# Altium schematic sheet PX4FMUv2.4.6_08.SchDoc: PX4FMUv2.4.6.sch
size 282 x 200 mm; Date: 2015/3/26 21:06:21; SheetNumber: Sheet:
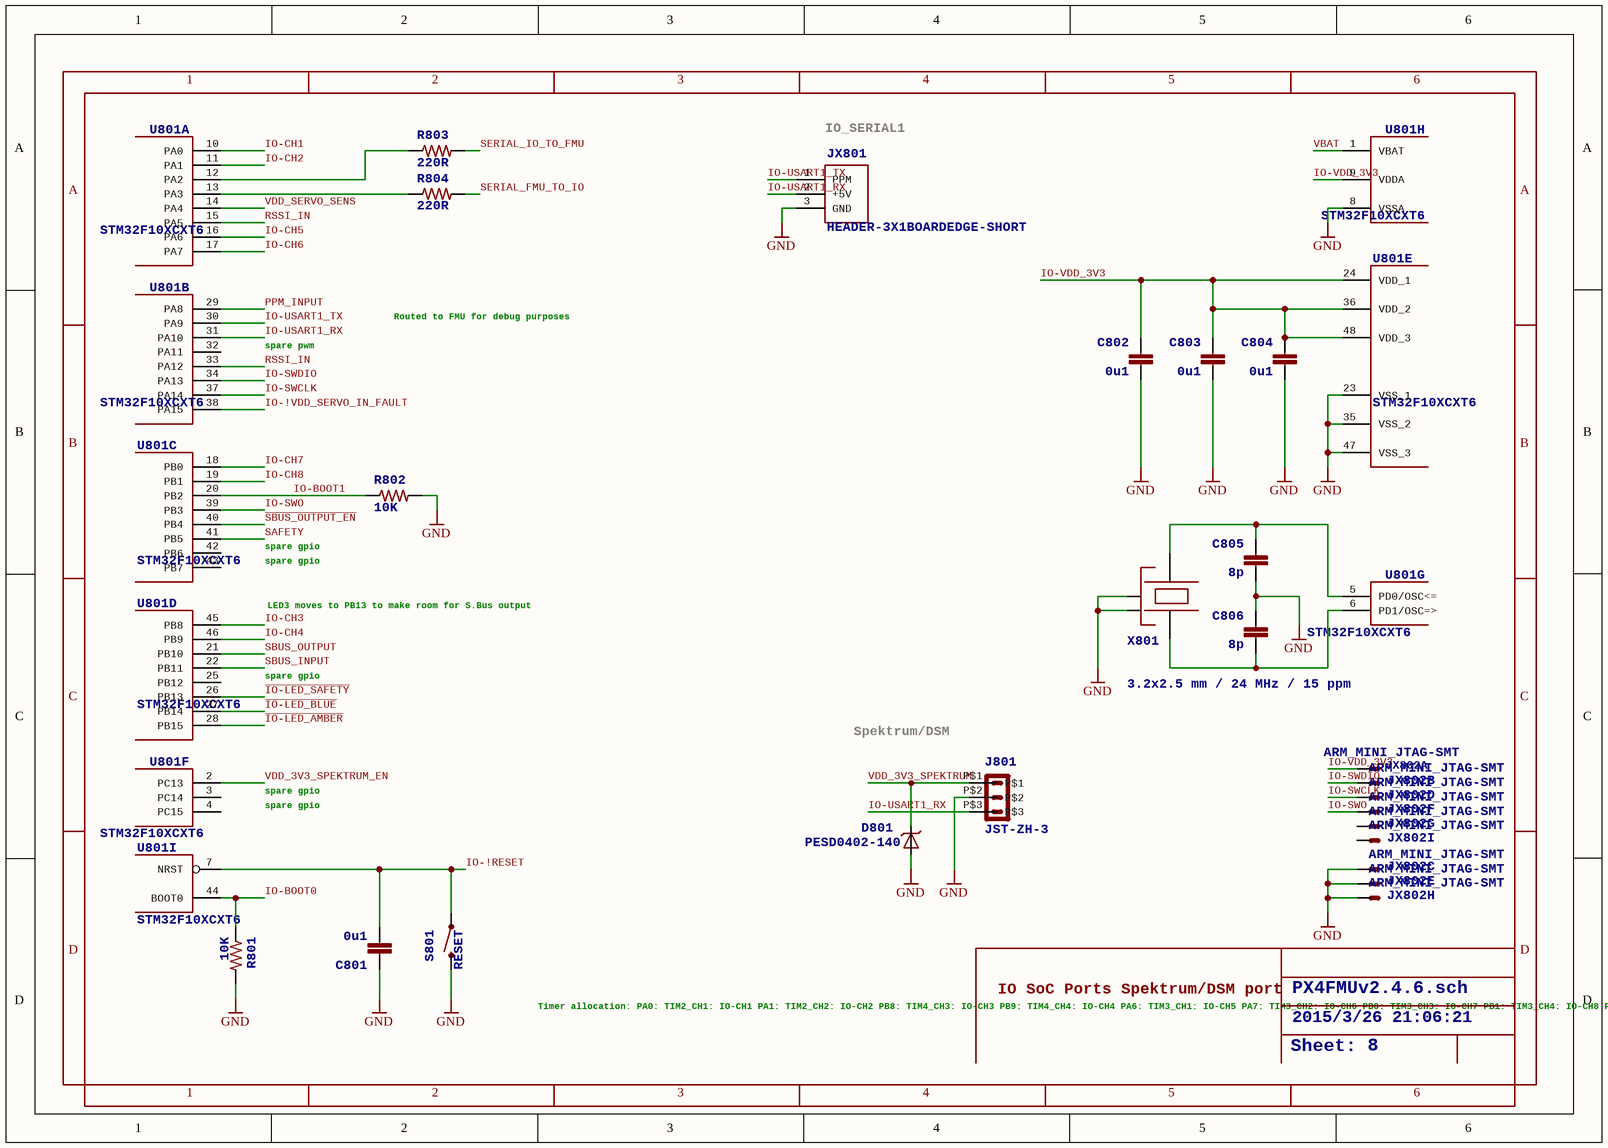
[diagram p0: PX4FMUv2.4.6_08.SchDoc]

## Parts
C801  0u1  [0402-CAP]
C802  0u1  [0402-CAP]
C803  0u1  [0402-CAP]
C804  0u1  [0402-CAP]
C805  8p  [0402-CAP]
C806  8p  [0402-CAP]
D801  PESD0402-140  [0402-TVS]
J801  JST-ZH-3  [JST-ZH-SMT-VERTICAL]
JX801  HEADER-3X1BOARDEDGE-SHORT  [HEADER_3X01_SMD_H_BOARD_EDGE_SHORT]
JX802  ARM_MINI_JTAG-SMT  [FTSH-105-01-XXX-DV-K]  (parts A,B,C,D,E,F,G,H,I of 9)
R801  10K  [0402-RES]
R802  10K  [0402-RES]
R803  220R  [0402-RES]
R804  220R  [0402-RES]
S801  RESET  [EVQP7J01K]
U801  STM32F10XCXT6  [TQFP48]  (parts A,B,C,D,E,F,G,H,I of 9)
X801  3.2x2.5 mm / 24 MHz / 15 ppm  [OSCILLATOR-3.2X2.5]

## Nets
GND: C801.P$1 C802.P$2 C803.P$2 C804.P$2 C805.P$2 C806.P$1 D801.A J801.P$2 JX801.3(GND) JX802.3(S) JX802.5(S) JX802.9(S) R801.P$2 R802.P$2 S801.B3 U801.8(VSSA) U801.23(VSS_1) U801.35(VSS_2) U801.47(VSS_3) X801.2(NC_2) X801.4(NC_4)
~{IO-LED_AMBER}: U801.28(PB15)
~{IO-LED_BLUE}: U801.27(PB14)
~{IO-LED_SAFETY}: U801.26(PB13)
IO-!RESET: C801.P$2 S801.A1 U801.7(NRST)
IO-!VDD_SERVO_IN_FAULT: U801.38(PA15)
IO-BOOT0: R801.P$1 U801.44(BOOT0)
IO-BOOT1: R802.P$1 U801.20(PB2)
IO-CH1: U801.10(PA0)
IO-CH2: U801.11(PA1)
IO-CH3: U801.45(PB8)
IO-CH4: U801.46(PB9)
IO-CH5: U801.16(PA6)
IO-CH6: U801.17(PA7)
IO-CH7: U801.18(PB0)
IO-CH8: U801.19(PB1)
IO-SWCLK: JX802.4(S) U801.37(PA14)
IO-SWDIO: JX802.2(S) U801.34(PA13)
IO-SWO: JX802.6(S) U801.39(PB3)
IO-USART1_RX: J801.P$3 JX801.2(+5V) U801.31(PA10)
IO-USART1_TX: JX801.1(PPM) U801.30(PA9)
IO-VDD_3V3: C802.P$1 C803.P$1 C804.P$1 JX802.1(S) U801.9(VDDA) U801.24(VDD_1) U801.36(VDD_2) U801.48(VDD_3)
PPM_INPUT: U801.29(PA8)
RSSI_IN: U801.15(PA5) U801.33(PA12)
~{SBUS_OUTPUT_EN}: U801.40(PB4)
SAFETY: U801.41(PB5)
SBUS_INPUT: U801.22(PB11)
SBUS_OUTPUT: U801.21(PB10)
SERIAL_FMU_TO_IO: R804.P$2
SERIAL_IO_TO_FMU: R803.P$2
VBAT: U801.1(VBAT)
VDD_3V3_SPEKTRUM: D801.C J801.P$1
VDD_3V3_SPEKTRUM_EN: U801.2(PC13)
VDD_SERVO_SENS: U801.14(PA4)
NetC805_P$1: C805.P$1 U801.5(PD0/OSC<=) X801.3
NetC806_P$2: C806.P$2 U801.6(PD1/OSC=>) X801.1
NetR803_P$1: R803.P$1 U801.12(PA2)
NetR804_P$1: R804.P$1 U801.13(PA3)

Not connected (* = marked no-connect by the designer): JX802 8(S) 10(S); U801 3(PC14) 4(PC15) 25(PB12) 32(PA11) 42(PB6) 43(PB7)

## Notes on the sheet
- (near JX801) IO_SERIAL1
- spare pwm
- Routed to FMU for debug purposes
- spare gpio
- LED3 moves to PB13 to make room for S.Bus output
- Spektrum/DSM
- Timer allocation:
  PA0: TIM2_CH1: IO-CH1
  PA1: TIM2_CH2: IO-CH2
  PB8: TIM4_CH3: IO-CH3
  PB9: TIM4_CH4: IO-CH4
  PA6: TIM3_CH1: IO-CH5
  PA7: TIM3_CH2: IO-CH6
  PB0: TIM3_CH3: IO-CH7
  PB1: TIM3_CH4: IO-CH8
  PA8: TIM1_CH1: PPM_IN
  PA11: TIM1_CH4: RSSI_IN
- IO SoC Ports
  Spektrum/DSM port
- 1
- 2
- 3
- 4
- 5
- 6
- A
- B
- C
- D

## Library data of the parts
C801-C804 = CAP0402: <b>Capacitor</b> / Standard 0603 ceramic capacitor, and 0.1" leaded capacitor.; PARTNO: CC0402ZRY5V7BB104
C805 C806 = CAP0402: <b>Capacitor</b> / Standard 0603 ceramic capacitor, and 0.1" leaded capacitor.; PARTNO: C1005C0G1H080C
D801 = DIODE-TVS
J801 = JST-ZH-3: PARTNO: B3B-ZR-SM4-TF (LF)(SN)(P)
JX801 = HEADER-3X1BOARDEDGE-SHORT: <h3>Single row 0.1" servo header</h3>; BOM: EXCLUDE
JX802 = ARM_MINI_JTAG-SMT: <b>CONNECTOR</b><p> / wire to board 1.25 mm (.049 inch) pitch header; PARTNO: M50-3900542; BOM: EXCLUDE
R801 R802 = RESISTOR0402-RES: <b>Resistor</b> / Basic schematic elements and footprints for 0603, 1206, and PTH 1/10th watt (small) resistors.; PARTNO: RC0402FR-0710KL
R803 R804 = RESISTOR0402-RES: <b>Resistor</b> / Basic schematic elements and footprints for 0603, 1206, and PTH 1/10th watt (small) resistors.; PARTNO: RC0402FR-07220RL
S801 = SWITCH-MOMENTARY-2: PARTNO: EVQ-P7J01P
U801 = STM32F10XCXT6: ST STM32F101/103 48pin LQFP; PARTNO: STM32F100C8T6B
X801 = OSCILLATOR-3.2X2.5: Crystal Oscillator in 3.2x2.5 SMD